# Altium schematic sheet Motor_Driver.SchDoc
size Tabloid; SheetNumber: 4; SheetTotal: 4
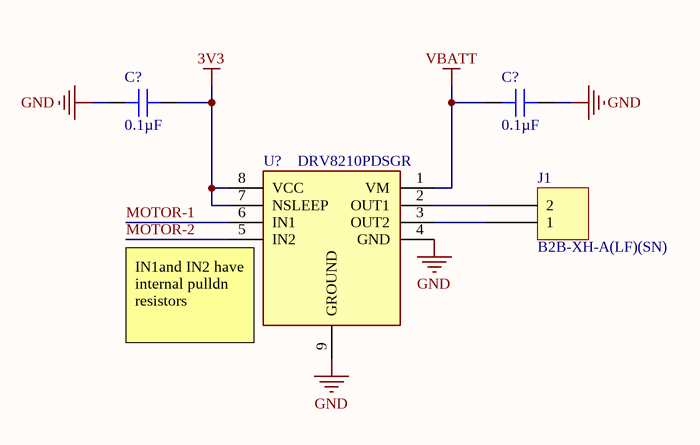
[diagram p0: Motor_Driver.SchDoc]

## Parts
(Parts that share a designator on the sheet are numbered #1, #2 ... from top to bottom, then left to right.)
C?#1  0.1µF  [CAP 0603_1608]
C?#2  0.1µF  [CAP 0603_1608]
J1  B2B-XH-A(LF)(SN)  [JST XH B2B-XH-A]
U?  DRV8210PDSGR  [SON50P200X200X80-9N]

## Nets
3V3: C?#1.2 U?.7(NSLEEP) U?.8(VCC)
GND: C?#1.1 C?#2.2 U?.4(GND) U?.9(GROUND)
VBATT: C?#2.1 U?.1(VM)
MOTOR-1: U?.6(IN1)
MOTOR-2: U?.5(IN2)
NetJ1_1: J1.1 U?.3(OUT2)
NetJ1_2: J1.2 U?.2(OUT1)

## Notes on the sheet
- (near U?) IN1and IN2 have internal pulldn resistors
- Insert really cool logo here
- Really_Cool_Title:
- Revision:
- Desciption:
- Version:
- Engineer:

## Library data of the parts
C?#1 C?#2 = 06033G104MAT2A: CAP CER 0.1UF 25V Y5V 0603; manufacturer: AVX Corporation; Temperature Coefficient: Y5V (F); Tolerance: ±20%; Part Number: 06033G104MAT2A; Value: 0.1µF; Applications: General Purpose; Capacitance: 0.1µF; componentlink1description: Datasheet; componentlink1url: http://datasheets.avx.com/Y5V.pdf; componentlink2description: DigiKey Link; componentlink2url: http://digikey.com/product-detail/en/avx-corporation/06033G104MAT2A/478-11369-1-ND/8019122; Device Package: 0603 (1608 Metric); lastupdated: 9/2/2020 1:03:16 AM; Lifecycle Status: Active; Minimum Order: 1; Mounting Type: Surface Mount, MLCC; Operating Temperature: -30°C ~ 85°C; Package / Case: 0603 (1608 Metric); packaging: TapeAndReel; partid: 13439; Part Status: Active; price: 0.02; series: -; Size / Dimension: 0.063" L x 0.032" W (1.60mm x 0.81mm); Supplier 1: DigiKey; Supplier Part Number 1: 478-11369-1-ND; Thickness (Max): 0.035" (0.90mm); Voltage - Rated: 25V
J1 = B2B-XH-A(LF)(SN): CONN HEADER VERT 2POS 2.5MM; Manufacturer: JST Sales America Inc.; Contact Length - Post: 0.134" (3.40mm); Current Rating (Amps): 3A; Material Flammability Rating: UL94 V-0; Number of Positions: 2; Number of Positions Loaded: All; Pitch - Mating: 0.098" (2.50mm); Shrouding: Shrouded - 4 Wall; Style: Board to Cable/Wire; Voltage Rating: 250V; Part Number: B2B-XH-A(LF)(SN); ComponentLink1Description: Datasheet; ComponentLink1URL: http://www.jst-mfg.com/product/pdf/eng/eXH.pdf; ComponentLink2Description: DigiKey Link; ComponentLink2URL: http://digikey.com/product-detail/en/jst-sales-america-inc/B2B-XH-A-LF-SN/455-2247-ND/1651045; Connector Type: Header; Contact Finish - Mating: Tin; Contact Finish - Post: Tin; Contact Material: Brass; Contact Shape: Square; Contact Type: Male Pin; Fastening Type: Detent Lock; Insulation Color: Natural; Insulation Height: 0.276" (7.00mm); Insulation Material: Polyamide (PA66), Nylon 6/6; LastUpdated: 1/12/2020 11:46:08 PM; Lifecycle Status: Active; Minimum Order: 1; Mounting Type: Through Hole; Number of Rows: 1; Operating Temperature: -25°C ~ 85°C; Packaging: Bulk; PartId: 67; Part Status: Active; Price: 0.15; Series: XH; Supplier 1: DigiKey; Supplier Part Number 1: 455-2247-ND; Termination: Press-Fit, Solder
U? = DRV8210PDSGR: Integrated Circuit; Manufacturer_Name: Texas Instruments; Datasheet Link: https://www.ti.com/lit/gpn/drv8210p; Height: 0.8mm; Manufacturer_Part_Number: DRV8210PDSGR; Mouser Part Number: 595-DRV8210PDSGR; Mouser Price/Stock: https://www.mouser.co.uk/ProductDetail/Texas-Instruments/DRV8210PDSGR?qs=eP2BKZSCXI76Q1gdVPvR3A%3D%3D; Arrow Part Number: DRV8210PDSGR; Arrow Price/Stock: https://www.arrow.com/en/products/drv8210pdsgr/texas-instruments?region=nac